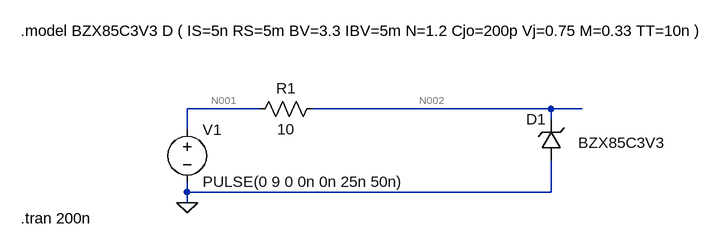
[diagram p0: schematic Clock clamping.asc]
Clock clamping.asc, the LTspice schematic file:
Version 4
SHEET 1 1100 680
WIRE 320 192 208 192
WIRE 768 192 400 192
WIRE 816 192 768 192
WIRE 768 208 768 192
WIRE 208 224 208 192
WIRE 208 320 208 304
WIRE 768 320 768 272
WIRE 768 320 208 320
WIRE 208 336 208 320
FLAG 208 336 0
SYMBOL zener 784 272 R180
WINDOW 0 24 64 Left 2
WINDOW 3 -159 28 Left 2
SYMATTR InstName D1
SYMATTR Value BZX85C3V3
SYMBOL voltage 208 208 R0
WINDOW 123 0 0 Left 0
WINDOW 39 0 0 Left 0
SYMATTR InstName V1
SYMATTR Value PULSE(0 9 0 0n 0n 25n 50n)
SYMBOL res 416 176 R90
WINDOW 0 0 56 VBottom 2
WINDOW 3 32 56 VTop 2
SYMATTR InstName R1
SYMATTR Value 10
TEXT -48 72 Left 2 !.model BZX85C3V3 D ( IS=5n RS=5m BV=3.3 IBV=5m N=1.2 Cjo=200p Vj=0.75 M=0.33 TT=10n )
TEXT -48 360 Left 2 !.tran 200n

The netlist it stands for:
* Clock clamping.asc
D1 0 N002 BZX85C3V3
V1 N001 0 PULSE(0 9 0 0n 0n 25n 50n)
R1 N002 N001 10
.model D D
.lib standard.dio
.model BZX85C3V3 D ( IS=5n RS=5m BV=3.3 IBV=5m N=1.2 Cjo=200p Vj=0.75 M=0.33 TT=10n )
.tran 200n
.backanno
.end

* Results of the author's LTspice run, read from the files saved beside the schematic
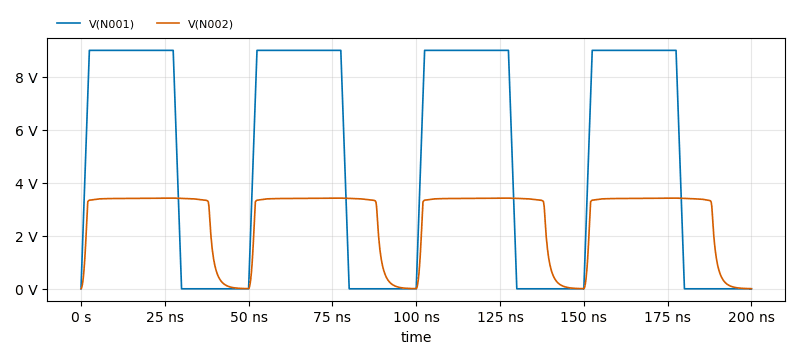
[diagram p1: Transient Analysis of Clock clamping.asc, plotted from the saved traces]
* Transient Analysis, 1 run:
*   V(N001): min 0 V, max 9 V, average 4.95 V, rms 6.586 V, last 0 V
*   V(N002): min 0 V, max 3.423 V, average 2.598 V, rms 2.931 V, last 4.253 mV